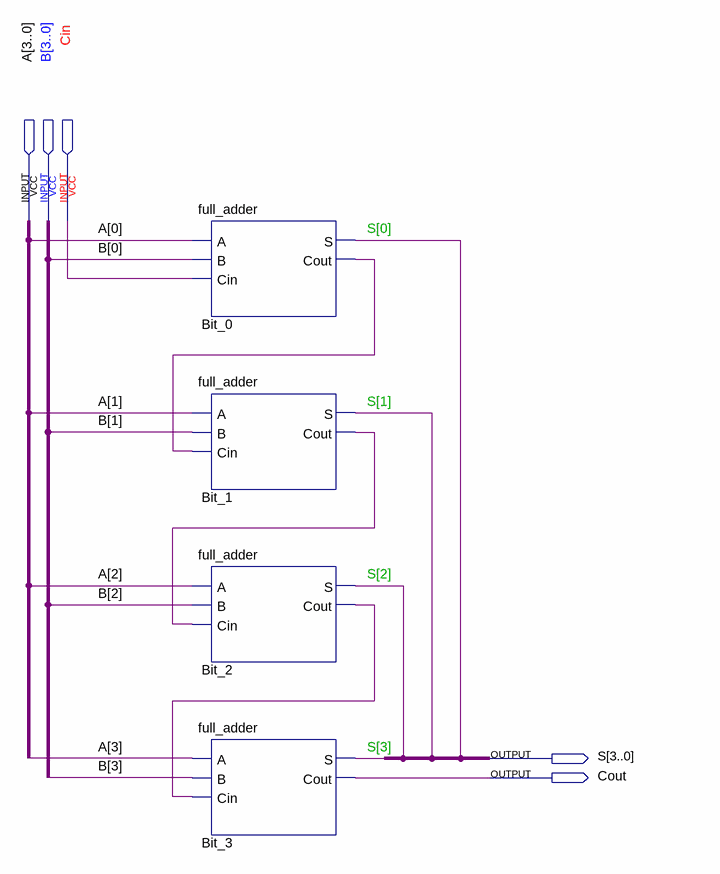
[diagram p0: schematic sheet]
// Quartus schematic full_adder_4b.bdf as structural Verilog: 4 symbols, 5 pins
module full_adder_4b (
  input  [3:0] A,
  input  [3:0] B,
  input  Cin,
  output [3:0] S,
  output Cout
);

  wire Bit_0_cout, Bit_1_cout, Bit_2_cout;

  full_adder Bit_0 (.A(A[0]), .B(B[0]), .Cin(Cin), .S(S[0]), .Cout(Bit_0_cout));
  full_adder Bit_1 (.A(A[1]), .B(B[1]), .Cin(Bit_0_cout), .S(S[1]), .Cout(Bit_1_cout));
  full_adder Bit_2 (.A(A[2]), .B(B[2]), .Cin(Bit_1_cout), .S(S[2]), .Cout(Bit_2_cout));
  full_adder Bit_3 (.A(A[3]), .B(B[3]), .Cin(Bit_2_cout), .S(S[3]), .Cout(Cout));
endmodule
